# EAGLE design geiger-v2 (EAGLE 9.6.2)
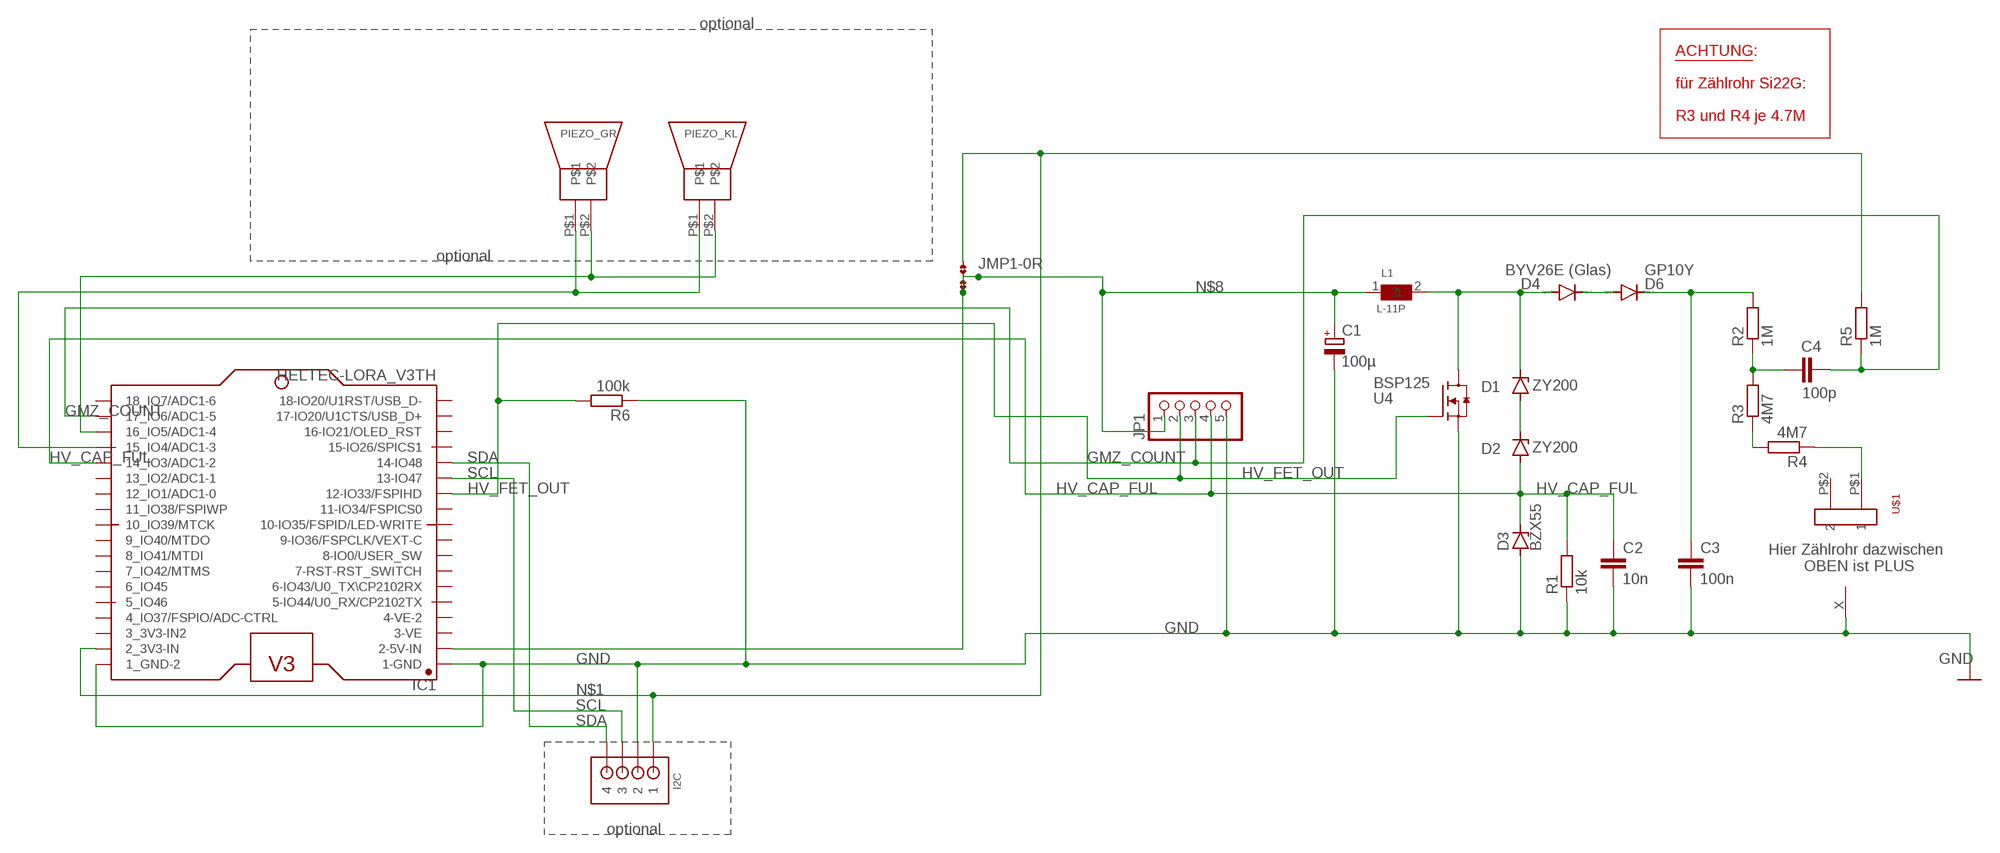
[diagram p0: schematic, sheet 1]

## Parts
C1  100µ  CPOL-EUE2-5  [E2-5]
C2  10n  C-EU050-035X075  [C050-035X075]
C3  100n  C-EU150-072X183  [C150-072X183]
C4  100p  C-EU050-045X075  [C050-045X075]
D1  ZY200  ZENER-DIODEDO41Z10  [DO41Z10]
D2  ZY200  ZENER-DIODEDO41Z10  [DO41Z10]
D3  BZX55  [DO35Z10]
D4  BYV26E (Glas)  1N4004  [DO41-10]
D6  GP10Y  1N4004  [DO41-10]
I2C  B4B-ZRSIDE_ENTRY  [S4B-ZR]
IC1  HELTEC-LORA_V3TH  [HELTEC_LORA_32]
JMP1  0R-JUMPB  [B0R-JMP]
JP1  PINHD-1X5  [1X05]
L1  L-11P  [L-11P]
PIEZO_GR  PIEPSER_BIG  [PIEPSER_BIG]
PIEZO_KL  PIEPSER  [PIEPSER]
R1  10k  R-EU_0207/10  [0207/10]
R2  1M  R-EU_0207/10  [0207/10]
R3  4M7  R-EU_0207/10  [0207/10]
R4  4M7  R-EU_0207/10  [0207/10]
R5  1M  R-EU_0207/10  [0207/10]
R6  100k  R-EU_0207/10  [0207/10]
U4  BSP125  [SOT223]
U$1  FUSE_HOLDER  [FUSE_HOLDER]
U$5  ONE_PAD  [ONE_PAD]

## Nets
GMZ_COUNT: C4.2 IC1.17_(17_IO6/ADC1-5) JP1.3 R5.1
GND: C1.- C2.2 C3.2 D3.A I2C.2 IC1.1-(1-GND) IC1.1_(1_GND-2) JP1.5 R1.1 R6.1 U4.3(S) U$5.X
HV_CAP_FUL: C2.1 D2.A D3.C IC1.14_(14_IO3/ADC1-2) JP1.4 R1.2
HV_FET_OUT: IC1.12-(12-IO33/FSPIHD) JP1.2 R6.2 U4.1(G)
N$1: I2C.1 IC1.2_(2_3V3-IN) JMP1.1 R5.2
N$2: D1.A D2.C
N$3: D1.C D4.A L1.2 U4.2(D) U4.4(D)
N$4: C3.1 D6.C R2.2
N$5: R4.1 U$1.P$1
N$6: R3.1 R4.2
N$7: C4.1 R2.1 R3.2
N$8: C1.+ IC1.2-(2-5V-IN) JMP1.2 JMP1.3 JP1.1 L1.1
N$9: D4.C D6.A
N$13: IC1.16_(16_IO5/ADC1-4) PIEZO_GR.P$2 PIEZO_KL.P$2
N$14: IC1.15_(15_IO4/ADC1-3) PIEZO_GR.P$1 PIEZO_KL.P$1
SCL: I2C.3 IC1.13-(13-IO47)
SDA: I2C.4 IC1.14-(14-IO48)
Unconnected: IC1.3-(3-VE) IC1.4-(4-VE-2) IC1.4_(4_IO37/FSPIO/ADC-CTRL) IC1.5-(5-IO44/U0_RX/CP2102TX) IC1.5_(5_IO46) IC1.6-(6-IO43/U0_TX\CP2102RX) IC1.6_(6_IO45) IC1.7-(7-RST-RST_SWITCH) IC1.7_(7_IO42/MTMS) IC1.8-(8-IO0/USER_SW) IC1.8_(8_IO41/MTDI) IC1.9-(9-IO36/FSPCLK/VEXT-C) IC1.9_(9_IO40/MTDO) IC1.10-(10-IO35/FSPID/LED-WRITE) IC1.10_(10_IO39/MTCK) IC1.11.(11-IO34/FSPICS0) IC1.11_(11_IO38/FSPIWP) IC1.12_(12_IO1/ADC1-0) IC1.13_(13_IO2/ADC1-1) IC1.15-(15-IO26/SPICS1) IC1.16-(16-IO21/OLED_RST) IC1.17-(17-IO20/U1CTS/USB_D+) IC1.18-(18-IO20/U1RST/USB_D-) IC1.18_(18_IO7/ADC1-6) U$1.P$2

## Notes on the sheet
- optional
- ACHTUNG:
  
  für Zählrohr Si22G:
  
  R3 und R4 je 4.7M
- optional
- Hier Zählrohr dazwischen
          OBEN ist PLUS
- optional

## Power pins joined to a net without a drawn wire
3_3V3-IN2: IC1.3_(3_3V3-IN2)

## Library data of the parts
C1 = rcl:CPOL-EU: POLARIZED CAPACITOR, European symbol; SPICEPREFIX: C
C2-C4 = rcl:C-EU: CAPACITOR, European symbol; SPICEPREFIX: C
D1 D2 = diode:ZENER-DIODE: Z-Diode
D3 = tlc5940:BZX55: Z DIODE
D4 D6 = diode:1N4004: DIODE general purpose rectifier, 1 A
I2C = jst:B4B-ZR: JST-ZH Connector 4 pol, 1.5mm pitch Package: B4B-ZR Source: http://www.jst-mfg.com/product/pdf/eng/eZH.pdf
IC1 = Heltec_WiFi-LoRa-32:HELTEC-LORA_V3: Heltec WiFi LoRa 32 V3 Same footprint for V2 and V3, pinning is different Specification Details Master Chip ESP32-S3FN8 (Xtensa®32-bit lx7 dual core processor) LoRa Node Chip SX1262 USB to Serial Chip CP2102 Frequency 470~510MHz, 863~928MHz Max. TX Power 21±1dBm Max. Receiving Sensitivity -134dBm@SF12 BW=125KHz Wi-Fi 802.11 b/g/n, up to 150Mbps Bluetooth Bluetooth 5 (LE) Hardware Resource 7*ADC1 + 2*ADC2; 7*Touch; 3*UART; 2*I2C; 2*SPI; etc. Memory 384KB ROM; 512KB SRAM; 16KB RTC SRAM; 8MB SiP Flash Interface Type-C USB; 2*1.25 lithium battery interface; LoRa ANT (IPEX1.0); 2*18*2.54 Header Pin Battery 3.7V lithium battery power supply and charging Operating Temperature -20 ~ 70 ℃ Dimensions 50.2 * 25.5 * 10.2 mm Made by TrueLoveFour0 repo on GitHub <https://github.com/TrueLoveFor0/Heltec-Lora32-V2-Eagle-lib> Based on a lib from cartoonpiboon@gmail.com <url>
JMP1 = jump-0r-smd:0R-JUMP: SMD 0R 0805 Jumper
JP1 = pinhead:PINHD-1X5: PIN HEADER
L1 = tlc5940:L-11P
PIEZO_GR = tlc5940:PIEPSER_BIG
PIEZO_KL = tlc5940:PIEPSER
R1-R6 = rcl:R-EU_: RESISTOR, European symbol; SPICEPREFIX: R
U4 = tlc5940:BSP125
U$1 = tlc5940:FUSE_HOLDER
U$5 = tlc5940:ONE_PAD

## Net classes
0 default: clearance 0.205 mm

## Board
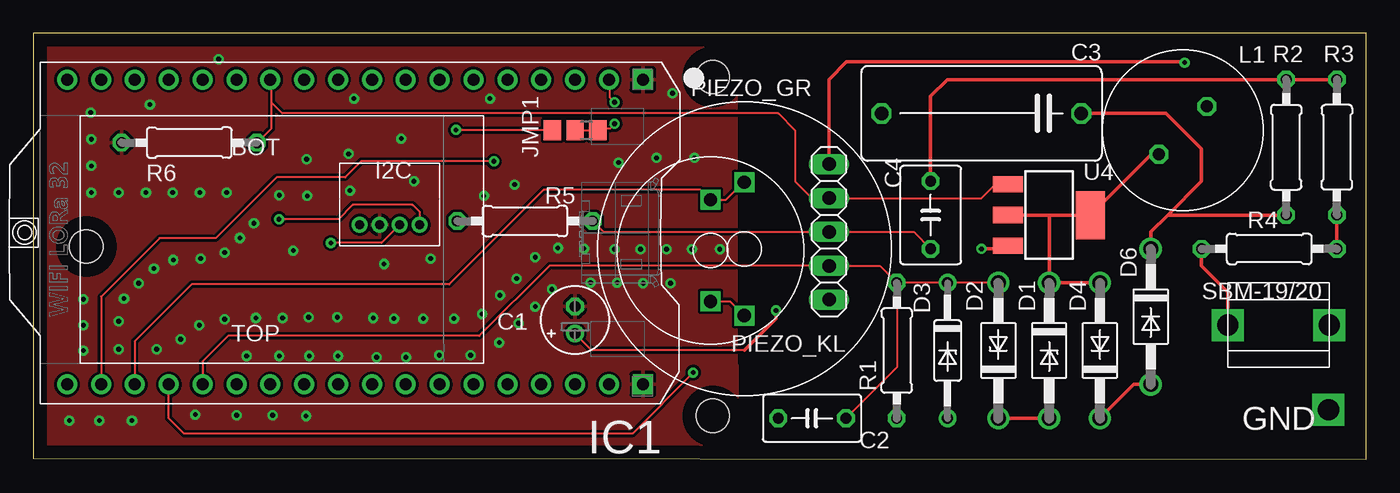
[diagram p1: board, top side]
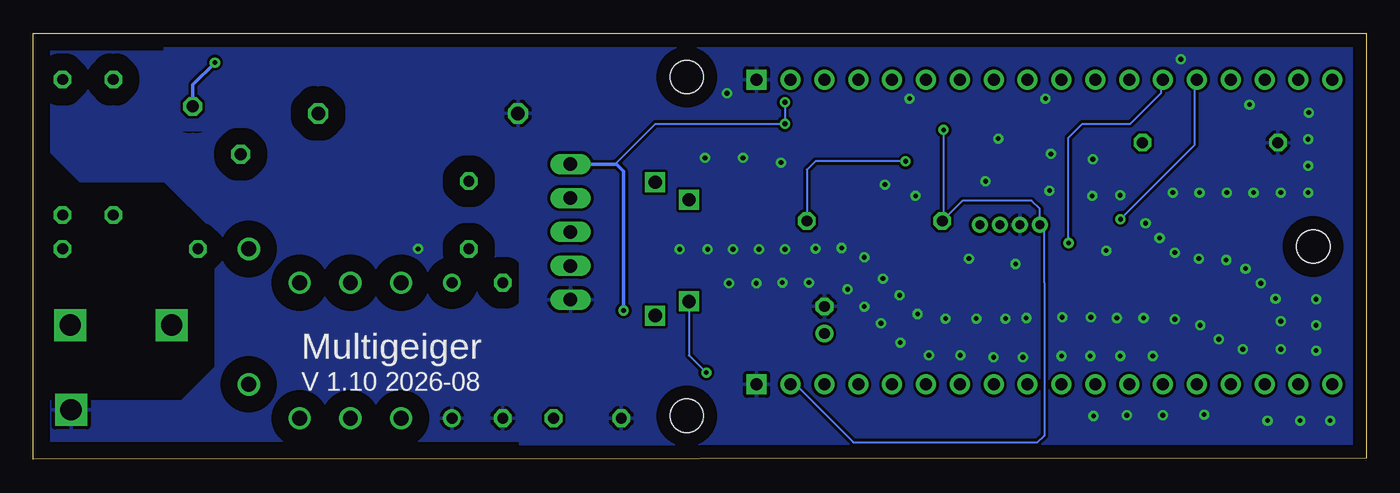
[diagram p2: board, bottom side, seen from below]

Size 99.98 x 31.94 mm. Coordinates in mm from the lower left corner, seen from the top.
Outline: 0,0.07 99.98,0 99.98,31.94 0,31.94 0,0.07
Copper layers (1*16): Top 0.035mm / dielectric 1.5mm / Bottom 0.035mm
Design rules "default": minimum track width 6mil, minimum drill 0.35mm, track to track 6mil, track to pad 6mil, pad to pad 6mil, via to via 6mil, smd to smd 6mil, copper to edge 40mil, drill to drill 6mil, minimum pad ring 10mil, minimum via ring 8mil, stop-mask expansion 4mil, vias tented up to drill 0mil, thermal gap 10mil
Holes 2.5 mm at 3.97,15.96 50.96,28.66 50.96,3.26

### Footprints (pad centres in the part's own frame; a part is rotated, then mirrored left to right if it is on the bottom)
E2-5 = drill 0.813 pad 1.27: + -1.016,0 | drill 0.813 pad 1.27 octagon: - 1.016,0
C050-035X075 = drill 0.813 octagon: 1 -2.54,0; 2 2.54,0
C150-072X183 = drill 1.016 octagon: 1 -7.493,0; 2 7.493,0
C050-045X075 = drill 0.813 octagon: 1 -2.54,0; 2 2.54,0
DO41Z10 = drill 1.118: A 5.08,0; C -5.08,0
DO35Z10 = drill 0.813: A 5.08,0; C -5.08,0
DO41-10 = drill 1.118: A 5.08,0; C -5.08,0
S4B-ZR = drill 0.7: 1 6,2; 2 4.5,2; 3 3,2; 4 1.5,2
HELTEC_LORA_32 = drill 0.9 pad 1.5 square: 1- 0,0; 1_ 0,22.86 | drill 0.9 pad 1.5: 2- 2.54,0; 2_ 2.54,22.86; 3- 5.08,0; 3_ 5.08,22.86; 4- 7.62,0; 4_ 7.62,22.86; 5- 10.16,0; 5_ 10.16,22.86; 6- 12.7,0; 6_ 12.7,22.86; 7- 15.24,0; 7_ 15.24,22.86; 8- 17.78,0; 8_ 17.78,22.86; 9- 20.32,0; 9_ 20.32,22.86; 10- 22.86,0; 10_ 22.86,22.86; 11. 25.4,0; 11_ 25.4,22.86; 12- 27.94,0; 12_ 27.94,22.86; 13- 30.48,0; 13_ 30.48,22.86; 14- 33.02,0; 14_ 33.02,22.86; 15- 35.56,0; 15_ 35.56,22.86; 16- 38.1,0; 16_ 38.1,22.86; 17- 40.64,0; 17_ 40.64,22.86; 18- 43.18,0; 18_ 43.18,22.86
B0R-JMP = smd 1.5 x 1.3: 1 0,1.7; 2 0,0; 3 0,-1.7
1X05 = drill 1.016 long: 1 -5.08,0; 2 -2.54,0; 3 0,0; 4 2.54,0; 5 5.08,0
L-11P = drill 0.9 octagon: 1 -2.54,0; 2 2.54,0
PIEPSER_BIG = drill 1 square: P$1 -5,0; P$2 5,0
PIEPSER = drill 1 square: P$1 -3.81,0; P$2 3.81,0
0207/10 = drill 0.813 octagon: 1 -5.08,0; 2 5.08,0
SOT223 = smd 1.219 x 2.235: 1 -2.311,-3.099; 2 0,-3.099; 3 2.311,-3.099 | smd 3.6 x 2.2: 4 0,3.099
FUSE_HOLDER = drill 1.6 square: P$1 -3.81,0.635; P$2 3.81,0.635
ONE_PAD = drill 1.6 square: X 0,0

### Placement (x,y rotation side)
C1  40.64,10.44 90 top
C2  58.42,3.08 180 top
C3  71.12,25.94 180 top
C4  67.31,18.32 270 top
D1  76.2,8.16 270 top
D2  72.39,8.16 90 top
D3  68.58,8.16 270 top
D4  80.01,8.16 90 top
D6  83.82,10.7 270 top
I2C  30.48,19.59 180 top
IC1  45.72,28.48 180 top
JMP1  40.64,24.67 90 top
JP1  59.69,17.05 270 top
L1  86.23,24.67 225 top
PIEZO_GR  53.34,15.78 90 top
PIEZO_KL  50.8,15.65 90 top
R1  64.77,8.16 90 top
R2  93.98,23.4 270 top
R3  97.79,23.4 90 top
R4  92.71,15.78 0 top
R5  36.88,17.87 180 top
R6  11.7,23.75 0 top
U4  76.2,18.32 270 top
U$1  93.41,9.43 0 top
U$5  97.16,3.71 0 top

### Tracks (layer width: path | path; a pad name or v marks a point on that pad's centre or on a via)
GMZ_COUNT  (via drill 0.35)
  Top 0.152: C4.2 66.04,17.05 JP1.3 42.78,17.05 R5.1 | v34.55,22.35 24.6,22.35 23.4,21.15 18.25,21.15 13.68,16.58 9.47,16.58 5.08,12.2 IC1.17_
  Bottom 0.152: v34.55,22.35 41.33,22.35 41.96,21.72 R5.1
GND  (via drill 0.35)
  Top 0.254: U4.3 72.87,15.78 v71.12,15.78
  other vias: 4.3,26 4.35,24 4.35,22 4.35,20 6.4,20 8.45,20 10.45,20 12.5,20 14.5,20 18.45,19.8 20.55,19.75 23.75,20.15 20.5,22.5 23.65,22.9 16.55,17.7 15.5,16.6 14.35,15.5 12.55,15.05 10.5,14.95 9.05,14.3 7.9,13.2 6.8,12.05 6.4,10.35 6.4,8.25 3.75,8.15 3.75,10.05 3.75,12 2.7,2.9 4.95,2.9 7.4,2.9 12.15,3.35 15.25,3.3 17.95,3.3 20.45,3.25 16,7.75 18.45,7.75 20.7,7.75 22.85,7.75 25.75,7.65 27.95,7.65 30.45,7.8 32.8,7.8 34.95,8.75 36.4,10.2 37.65,11.45 38.9,12.75 41.8,13.25 43.8,13.25 45.75,13.2 47.8,13.2 51.5,15.75 49.4,15.75 47.5,15.75 45.55,15.75 43.6,15.75 41.3,15.8 39.35,15.85 37.65,15.15 36.25,13.55 35,12.3 33.65,10.9 31.55,10.55 29.25,10.55 27.05,10.55 25.5,10.6 22.8,10.65 20.65,10.65 18.7,10.6 16.7,10.6 14.35,10.5 12.45,10.05 11.05,9 9.25,8.25 19.5,15.65 26.3,14.65 29.8,15.05 28.55,20.85 33.8,19.75 36.1,20.6 27.6,24.05 43.9,22.25 46.75,22.6 49.6,22.6 47.95,27.45 34.25,27.05 24.05,27.05 13.9,30 8.75,26.6
  pour Bottom: -0.3,31.77 90.17,31.77 90.17,24.67 86.36,24.67 82.55,28.48 63.5,28.48 63.5,-0.14 0.59,-0.14
  pour Bottom (isolate 1.27): 60.96,-0.73 60.96,32.29 100.33,32.29 100.33,24.67 96.52,20.86 90.17,20.86 86.36,17.05 86.36,6.89 88.9,4.35 100.33,4.35 100.33,-0.73
  pour Top: 0,31.9 0,0.1 0.05,0.05 52.85,0.05 52.85,7.05 52.8,7.1 52.8,31.85 52.7,31.95 0.05,31.95
HV_CAP_FUL
  Top 0.152: D2.A D3.C R1.2 | R1.2 64.77,6.89 C2.1 | R1.2 63.5,14.51 JP1.4 59.69,14.53 38.73,14.53 33.45,9.25 14.6,9.25 12.7,7.35 IC1.14_
HV_FET_OUT
  Top 0.152: U4.1 72.87,20.86 72.39,20.86 71.12,19.59 JP1.2 58.42,19.59 57.15,20.86 57.15,24.67 55.88,25.94 18.68,25.94 17.87,26.75 | 17.87,26.75 17.87,26.9 17.87,28.38 IC1.12- | R6.2 17.87,24.84 17.87,26.75
N$1  (via drill 0.35)
  Top 0.152: JMP1.1 31.78,24.67 31.75,24.7 v31.7,24.7
  Bottom 0.152: IC1.2_ 43.07,5.5 42.71,5.5 38.48,1.27 27.94,1.27 24.67,1.27 24.16,1.78 24.15,1.77 24.15,13.25 24.14,17.25 I2C.1 24.48,18.78 25.1,19.4 30.27,19.4 31.64,18.03 | 31.64,18.03 R5.2 | v31.7,24.7 31.7,18.1 31.64,18.03
N$2
  Top 0.254: D1.A D2.C
N$3
  Top 0.254: U4.2 76.2,18.32 | 76.2,18.32 U4.4 83.85,22.87 L1.2 | 76.2,18.32 D1.C D4.A
N$4
  Top 0.254: D6.C 83.82,17.05 85.09,18.32 | C3.1 84.96,25.94 87.63,23.27 87.63,20.86 85.09,18.32 | R2.2 85.09,18.32
N$5
  Top 0.254: R4.1 87.63,15.01 87.63,14.51 89.6,12.54 U$1.P$1
N$6
  Top 0.254: R3.1 R4.2
N$7
  Top 0.254: C4.1 67.31,27.21 68.58,28.48 R2.1 R3.2
N$8  (via drill 0.35)
  Top 0.152: v43.6,25.16 43.24,24.8 42.35,24.8 JMP1.3 JMP1.2 | v43.6,26.77 43.24,27.13 43.24,28.38 IC1.2- | C1.+ 41.88,8.18 53.37,8.18
  Top 0.254: v55.71,11.16 55.71,10.53 53.37,8.18 | JP1.1 59.69,28.48 61.01,29.8 86.31,29.8 v86.36,29.75
  Bottom 0.152: v43.6,26.77 v43.6,25.16 v43.61,25.15 53.33,25.15 56.35,22.13
  Bottom 0.254: JP1.1 56.35,22.13 56.23,22.13 55.71,21.61 v55.71,11.16 | L1.1 88.03,28.08 v86.36,29.75
N$9
  Top 0.254: D4.C 82.55,5.62 D6.A
N$13
  Top 0.152: PIEZO_GR.P$2 53.26,20.78 51.94,19.46 PIEZO_KL.P$2 50.05,20.21 38.28,20.21 31.19,13.12 11.87,13.12 7.62,8.87 IC1.16_
N$14  (via drill 0.35)
  Top 0.152: IC1.15_ 10.16,3.08 11.31,1.93 44.93,1.93 v49.5,6.5 | PIEZO_KL.P$1 52.28,11.84 PIEZO_GR.P$1
  Bottom 0.152: PIEZO_KL.P$1 50.8,7.8 v49.5,6.5
SCL  (via drill 0.35)
  Top 0.152: I2C.3 26.11,16.22 v22.32,16.22
  Bottom 0.152: IC1.13- 15.37,28.38 15.37,27.48 17.7,25.15 21.3,25.15 22.32,24.12 v22.32,16.22
SDA  (via drill 0.35)
  Top 0.152: I2C.4 28.98,18.55 28.44,19.09 23.97,19.09 22.89,18.01 v18.43,18.01
  Bottom 0.152: v18.43,18.01 12.87,23.57 12.87,28.38 IC1.14-

### Text on the board
tNames: SBM-19/20 | GND
bNames: Multigeiger | V 1.10 2026-08